# Altium schematic sheet MotorDriver.SchDoc
size A4; DrawnBy: Emile Renaud; Revision: V1.0; SheetNumber: 4; SheetTotal: 5
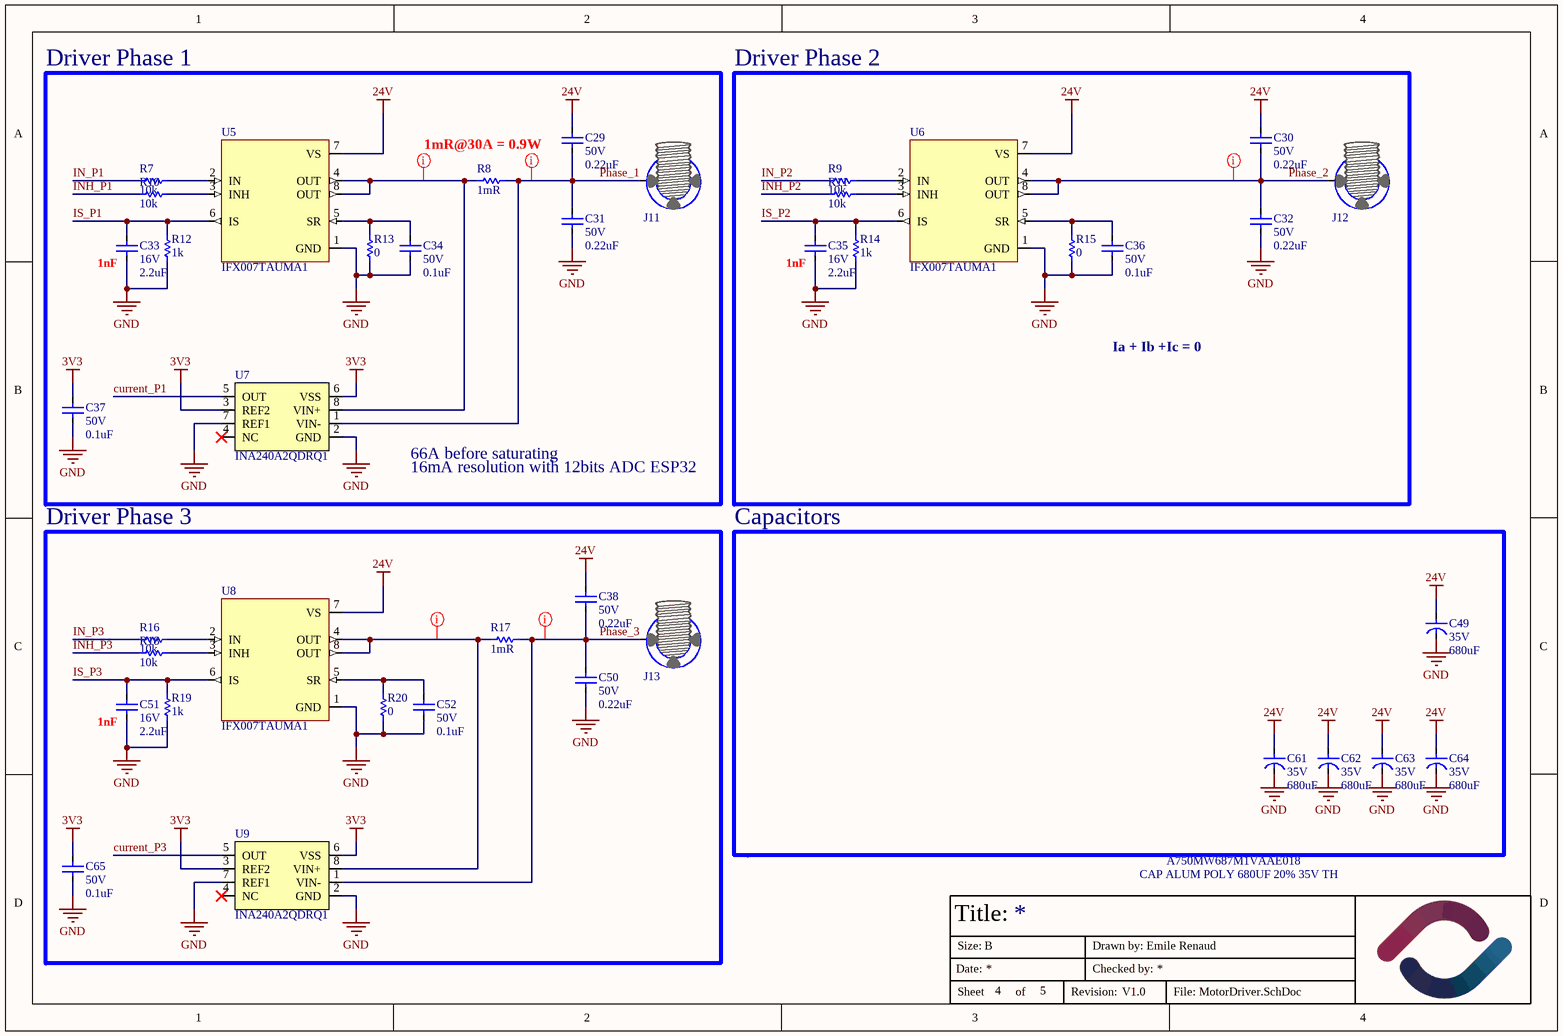
[diagram p0: MotorDriver.SchDoc]

## Parts
C29  value 0.22uF  Volt: 50V  [CAPACITOR-0603]  (hidden comment: Capacitor-0603-0.22uF-50V-X7R)
C30  value 0.22uF  Volt: 50V  [CAPACITOR-0603]  (hidden comment: Capacitor-0603-0.22uF-50V-X7R)
C31  value 0.22uF  Volt: 50V  [CAPACITOR-0603]  (hidden comment: Capacitor-0603-0.22uF-50V-X7R)
C32  value 0.22uF  Volt: 50V  [CAPACITOR-0603]  (hidden comment: Capacitor-0603-0.22uF-50V-X7R)
C33  value 2.2uF  Volt: 16V  [CAPACITOR-0603]  (hidden comment: Capacitor-0603-2.2uF-16V-X5R)
C34  value 0.1uF  Volt: 50V  [CAPACITOR-0603]  (hidden comment: Capacitor-0603-0.1uF-50V-X7R)
C35  value 2.2uF  Volt: 16V  [CAPACITOR-0603]  (hidden comment: Capacitor-0603-2.2uF-16V-X5R)
C36  value 0.1uF  Volt: 50V  [CAPACITOR-0603]  (hidden comment: Capacitor-0603-0.1uF-50V-X7R)
C37  value 0.1uF  Volt: 50V  [CAPACITOR-0603]  (hidden comment: Capacitor-0603-0.1uF-50V-X7R)
C38  value 0.22uF  Volt: 50V  [CAPACITOR-0603]  (hidden comment: Capacitor-0603-0.22uF-50V-X7R)
C49  value 680uF  Volt: 35V  [CAPACITOR-Aluminium-10.0x16mm-5mmPitch]  (hidden comment: CAP ALUM 680UF 20% 35V TH ESR 18mR)
C50  value 0.22uF  Volt: 50V  [CAPACITOR-0603]  (hidden comment: Capacitor-0603-0.22uF-50V-X7R)
C51  value 2.2uF  Volt: 16V  [CAPACITOR-0603]  (hidden comment: Capacitor-0603-2.2uF-16V-X5R)
C52  value 0.1uF  Volt: 50V  [CAPACITOR-0603]  (hidden comment: Capacitor-0603-0.1uF-50V-X7R)
C61  value 680uF  Volt: 35V  [CAPACITOR-Aluminium-10.0x16mm-5mmPitch]  (hidden comment: CAP ALUM 680UF 20% 35V TH ESR 18mR)
C62  value 680uF  Volt: 35V  [CAPACITOR-Aluminium-10.0x16mm-5mmPitch]  (hidden comment: CAP ALUM 680UF 20% 35V TH ESR 18mR)
C63  value 680uF  Volt: 35V  [CAPACITOR-Aluminium-10.0x16mm-5mmPitch]  (hidden comment: CAP ALUM 680UF 20% 35V TH ESR 18mR)
C64  value 680uF  Volt: 35V  [CAPACITOR-Aluminium-10.0x16mm-5mmPitch]  (hidden comment: CAP ALUM 680UF 20% 35V TH ESR 18mR)
C65  value 0.1uF  Volt: 50V  [CAPACITOR-0603]  (hidden comment: Capacitor-0603-0.1uF-50V-X7R)
J11  hole  [HOLE-M2-Bolt]  (value not drawn)  (no BOM)
J12  hole  [HOLE-M2-Bolt]  (value not drawn)  (no BOM)
J13  hole  [HOLE-M2-Bolt]  (value not drawn)  (no BOM)
R7  value 10k  [Resistor-0603]  (hidden comment: SMT resistor)
R8  value 1mR  [RESISTOR-3920]  (hidden comment: SMT resistor)
R9  value 10k  [Resistor-0603]  (hidden comment: SMT resistor)
R10  value 10k  [Resistor-0603]  (hidden comment: SMT resistor)
R11  value 10k  [Resistor-0603]  (hidden comment: SMT resistor)
R12  value 1k  [Resistor-0603]  (hidden comment: SMT resistor)
R13  value 0  [Resistor-0603]  (hidden comment: SMT resistor)
R14  value 1k  [Resistor-0603]  (hidden comment: SMT resistor)
R15  value 0  [Resistor-0603]  (hidden comment: SMT resistor)
R16  value 10k  [Resistor-0603]  (hidden comment: SMT resistor)
R17  value 1mR  [RESISTOR-3920]  (hidden comment: SMT resistor)
R18  value 10k  [Resistor-0603]  (hidden comment: SMT resistor)
R19  value 1k  [Resistor-0603]  (hidden comment: SMT resistor)
R20  value 0  [Resistor-0603]  (hidden comment: SMT resistor)
U5  IFX007TAUMA1  [DPAK127P1500X440-8N]
U6  IFX007TAUMA1  [DPAK127P1500X440-8N]
U7  INA240A2QDRQ1  [SOIC-8]
U8  IFX007TAUMA1  [DPAK127P1500X440-8N]
U9  INA240A2QDRQ1  [SOIC-8]

## Blocks framed on the sheet
Driver Phase 1: C29 C31 C33 C34 C37 J11 R7 R8 R10 R12 R13 U5 U7
Driver Phase 2: C30 C32 C35 C36 J12 R9 R11 R14 R15 U6
Driver Phase 3: C38 C50-C52 C65 J13 R16-R20 U8 U9
Capacitors: C49 C61-C64

## Nets
3V3: C37.2 C65.2 U7.3(REF2) U7.6(VSS) U9.3(REF2) U9.6(VSS)
24V: C29.2 C30.2 C38.2 C49.1 C61.1 C62.1 C63.1 C64.1 U5.7(VS) U6.7(VS) U8.7(VS)
GND: C31.1 C32.1 C33.1 C34.1 C35.1 C36.1 C37.1 C49.2 C50.1 C51.1 C52.1 C61.2 C62.2 C63.2 C64.2 C65.1 R12.1 R13.1 R14.1 R15.1 R19.1 R20.1 U5.1(GND) U6.1(GND) U7.2(GND) U7.7(REF1) U8.1(GND) U9.2(GND) U9.7(REF1)
current_P1: U7.5(OUT)
current_P3: U9.5(OUT)
IN_P1: R7.1
IN_P2: R9.1
IN_P3: R16.1
INH_P1: R10.1
INH_P2: R11.1
INH_P3: R18.1
IS_P1: C33.2 R12.2 U5.6(IS)
IS_P2: C35.2 R14.2 U6.6(IS)
IS_P3: C51.2 R19.2 U8.6(IS)
Phase_1: C29.1 C31.2 J11.1 R8.2 U7.1(VIN-)
Phase_2: C30.1 C32.2 J12.1 U6.4(OUT) U6.8(OUT)
Phase_3: C38.1 C50.2 J13.1 R17.2 U9.1(VIN-)
NetC34_2: C34.2 R13.2 U5.5(SR)
NetC36_2: C36.2 R15.2 U6.5(SR)
NetC52_2: C52.2 R20.2 U8.5(SR)
NetR7_2: R7.2 U5.2(IN)
NetR8_1: R8.1 U5.4(OUT) U5.8(OUT) U7.8(VIN+)
NetR9_2: R9.2 U6.2(IN)
NetR10_2: R10.2 U5.3(INH)
NetR11_2: R11.2 U6.3(INH)
NetR16_2: R16.2 U8.2(IN)
NetR17_1: R17.1 U8.4(OUT) U8.8(OUT) U9.8(VIN+)
NetR18_2: R18.2 U8.3(INH)

Not connected (* = marked no-connect by the designer): U7 4(NC)*; U9 4(NC)*

## Layout directives
net class Power: NetR8_1, NetR17_1, Phase_1, Phase_2, Phase_3

## Notes on the sheet
- (near R8) 1mR@30A = 0.9W
- (near C33) 1nF
- (near C35) 1nF
- Ia + Ib +Ic = 0
- 66A before saturating
- 16mA resolution with 12bits ADC ESP32
- (near C51) 1nF
- CAP ALUM POLY 680UF 20% 35V TH
- A750MW687M1VAAE018
- Title:
- Date:
- Size:
- B
- Drawn by:
- Checked by:
- Sheet
- of
- Revision:
- File:

## Library data of the parts
C29-C32 C38 C50 = Capacitor-0603-0.22uF-50V-X7R: Precision: X7R-10%; Package / Case: Metric 1608, EIA 0603; Mounted: Yes; Supplier 1: Digi-Key; Supplier Part Number 1: 1276-6600-1-ND; Supplier 2: Digi-Key
C33 C35 C51 = Capacitor-0603-2.2uF-16V-X5R: 2.2 µF ±10% 16V Ceramic Capacitor X5R 0603 (1608 Metric); Precision: X5R-10%; Mounted: Yes; Package / Case: Metric 1608 , EIA 0603; Supplier 1: Digikey; Supplier Part Number 1: 1276-1040-1-ND
C34 C36 C37 C52 C65 = Capacitor-0603-0.1uF-50V-X7R: Precision: X7R-10%; Package / Case: Metric 1608, EIA 0603; Mounted: Yes; Supplier 1: Digi-Key; Supplier Part Number 1: 1276-1935-2-ND; Supplier 2: Digi-Key; Supplier Part Number 2: 1276-1934-2-ND
C49 C61-C64 = Capacitor-680uF-35V-TH: Precision: 20%; Mounted: Yes; Supplier 1: Digi-Key; Supplier Part Number 1: 399-A750MW687M1VAAE018-ND; Supplier 2: Digi-Key; ESR: 18mR
J11-J13 = Hole 2.3mm M2: Hole for M2 Bolt with 4mm pad; Mounted: N/A
R7 R9-R11 R16 R18 = Resistor-0603-10k: Resistor0603-10k; Precision: 1%; Watt: 0.1W; Mounted: Yes; Package / Case: Metric 1608, EIA 0603; Supplier 1: Digi-Key; Supplier Part Number 1: 311-10.0KHRTR-ND
R8 R17 = Resistor-3920-1mR: Precision: 1%; Watt: 8W; Mounted: Yes; Package / Case: 3920; Supplier 1: Digi-Key; Supplier Part Number 1: 4506-PEWM3920D1L00K9CT-ND
R12 R14 R19 = Resistor-0603-1k: Resistor0603-1k; Precision: 1%; Watt: 0.1W; Mounted: Yes; Package / Case: Metric 1608, EIA 0603; Supplier 1: Digi-Key; Supplier Part Number 1: 311-1.00KHRCT-ND
R13 R15 R20 = Resistor-0603-0.0: Resistor0603-0.0; Precision: 1%; Watt: 0.1W; Mounted: Yes; Package / Case: Metric 1608, EIA 0603; Supplier 1: Digi-Key; Supplier Part Number 1: 311-0.0GRCT-ND
U5 U6 U8 = IFX007TAUMA1: Half Bridge Driver DC Motors, General Purpose Power MOSFET PG-TO263-7-1 55A 40V; Supplier 1: Digi-Key; Supplier Part Number 1: IFX007TAUMA1CT-ND; Package / Case: TO-263-8; Mounted: Yes
U7 U9 = INA240: Current Sense Amplifier 1 Circuit 8-SOIC 50 V/V; Supplier 1: Digi-Key; Supplier Part Number 1: 296-49647-1-ND; Package / Case: 8-SOIC; Mounted: Yes; helpURL: https://www.ti.com/general/docs/suppproductinfo.tsp?distId=10&gotoUrl=https%3A%2F%2Fwww.ti.com%2Flit%2Fgpn%2Fina240